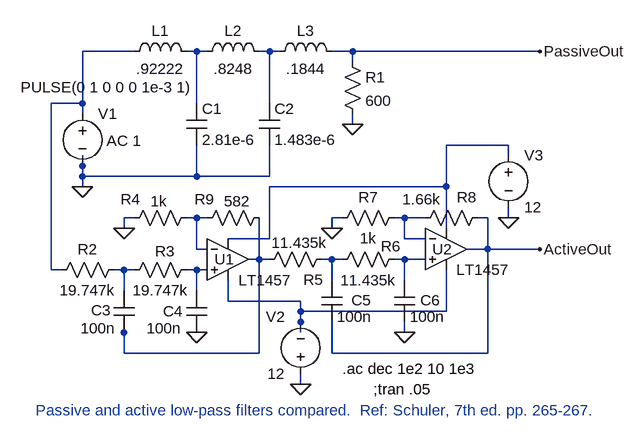
[diagram p0: schematic PassiveActive.asc]
PassiveActive.asc, the LTspice schematic file:
Version 4
SHEET 1 880 680
WIRE -224 -112 -304 -112
WIRE -128 -112 -144 -112
WIRE -112 -112 -128 -112
WIRE -16 -112 -32 -112
WIRE 0 -112 -16 -112
WIRE 112 -112 80 -112
WIRE 400 -112 112 -112
WIRE 112 -96 112 -112
WIRE -304 -32 -304 -112
WIRE -304 -32 -352 -32
WIRE -128 -32 -128 -112
WIRE -16 -32 -16 -112
WIRE -304 -16 -304 -32
WIRE 112 0 112 -16
WIRE 352 32 256 32
WIRE 352 48 352 32
WIRE -304 64 -304 48
WIRE -304 80 -304 64
WIRE -128 80 -128 32
WIRE -128 80 -304 80
WIRE -16 80 -16 32
WIRE -16 80 -128 80
WIRE -304 96 -304 80
WIRE 256 96 256 32
WIRE 256 96 -16 96
WIRE -224 144 -240 144
WIRE -128 144 -144 144
WIRE -112 144 -128 144
WIRE 96 144 80 144
WIRE 192 144 176 144
WIRE 224 144 192 144
WIRE 320 144 304 144
WIRE 352 144 352 128
WIRE -240 160 -240 144
WIRE 80 160 80 144
WIRE 256 160 256 96
WIRE -16 176 -16 96
WIRE -16 176 -80 176
WIRE 192 176 192 144
WIRE 224 176 192 176
WIRE -128 192 -128 144
WIRE -112 192 -128 192
WIRE 320 192 320 144
WIRE 320 192 288 192
WIRE 400 192 320 192
WIRE -32 208 -32 144
WIRE -32 208 -48 208
WIRE -16 208 -32 208
WIRE 80 208 64 208
WIRE 96 208 80 208
WIRE 192 208 176 208
WIRE 224 208 192 208
WIRE -352 224 -352 -32
WIRE -336 224 -352 224
WIRE -240 224 -256 224
WIRE -224 224 -240 224
WIRE -128 224 -144 224
WIRE -112 224 -128 224
WIRE 80 240 80 208
WIRE 192 240 192 208
WIRE -240 256 -240 224
WIRE -128 256 -128 224
WIRE -80 272 -80 240
WIRE 32 272 -80 272
WIRE 32 288 32 272
WIRE 256 288 256 224
WIRE 256 288 32 288
WIRE 32 304 32 288
WIRE -240 320 -240 304
WIRE -128 320 -128 304
WIRE 32 320 32 304
WIRE 192 320 192 304
WIRE -240 352 -240 320
WIRE -32 352 -32 208
WIRE -32 352 -240 352
WIRE 80 352 80 304
WIRE 320 352 320 192
WIRE 320 352 80 352
WIRE 32 400 32 384
FLAG -240 160 0
FLAG 80 160 0
FLAG -128 320 0
FLAG 192 320 0
FLAG 352 144 0
FLAG 32 400 0
FLAG 400 -112 PassiveOut
FLAG 400 192 ActiveOut
FLAG -304 96 0
FLAG 112 0 0
SYMBOL voltage -304 -32 R0
WINDOW 3 -95 -25 Left 0
WINDOW 123 37 57 Left 0
WINDOW 39 0 0 Left 0
SYMATTR Value PULSE(0 1 0 0 0 1e-3 1)
SYMATTR Value2 AC 1
SYMATTR InstName V1
SYMBOL ind -240 -96 R270
WINDOW 0 32 56 VTop 0
WINDOW 3 5 56 VBottom 0
SYMATTR InstName L1
SYMATTR Value .92222
SYMBOL ind -128 -96 R270
WINDOW 0 32 56 VTop 0
WINDOW 3 5 56 VBottom 0
SYMATTR InstName L2
SYMATTR Value .8248
SYMBOL ind -16 -96 R270
WINDOW 0 32 56 VTop 0
WINDOW 3 5 56 VBottom 0
SYMATTR InstName L3
SYMATTR Value .1844
SYMBOL res 96 -112 R0
SYMATTR InstName R1
SYMATTR Value 600
SYMBOL cap -144 -32 R0
SYMATTR InstName C1
SYMATTR Value 2.81e-6
SYMBOL cap -32 -32 R0
SYMATTR InstName C2
SYMATTR Value 1.483e-6
SYMBOL res -240 208 R90
WINDOW 0 0 56 VBottom 0
WINDOW 3 32 56 VTop 0
SYMATTR InstName R2
SYMATTR Value 19.747k
SYMBOL res -128 208 R90
WINDOW 0 3 49 VBottom 0
WINDOW 3 32 56 VTop 0
SYMATTR InstName R3
SYMATTR Value 19.747k
SYMBOL res -128 128 R90
WINDOW 0 3 102 VBottom 0
WINDOW 3 -25 58 VTop 0
SYMATTR InstName R4
SYMATTR Value 1k
SYMBOL res 80 192 R90
WINDOW 0 63 28 VBottom 0
WINDOW 3 -25 50 VTop 0
SYMATTR InstName R5
SYMATTR Value 11.435k
SYMBOL res 192 192 R90
WINDOW 0 11 21 VBottom 0
WINDOW 3 32 56 VTop 0
SYMATTR InstName R6
SYMATTR Value 11.435k
SYMBOL res 192 128 R90
WINDOW 0 0 56 VBottom 0
WINDOW 3 32 56 VTop 0
SYMATTR InstName R7
SYMATTR Value 1k
SYMBOL res 320 128 R90
WINDOW 0 0 32 VBottom 0
WINDOW 3 -28 102 VTop 0
SYMATTR InstName R8
SYMATTR Value 1.66k
SYMBOL res -16 128 R90
WINDOW 0 3 100 VBottom 0
WINDOW 3 -25 50 VTop 0
SYMATTR InstName R9
SYMATTR Value 582
SYMBOL cap -256 256 R0
WINDOW 0 -35 30 Left 0
WINDOW 3 -51 58 Left 0
SYMATTR InstName C3
SYMATTR Value 100n
SYMBOL cap -144 256 R0
WINDOW 0 -36 32 Left 0
WINDOW 3 -61 58 Left 0
SYMATTR InstName C4
SYMATTR Value 100n
SYMBOL cap 64 240 R0
WINDOW 0 46 31 Left 0
SYMATTR InstName C5
SYMATTR Value 100n
SYMBOL cap 176 240 R0
WINDOW 0 40 31 Left 0
SYMATTR InstName C6
SYMATTR Value 100n
SYMBOL voltage 32 400 R180
WINDOW 0 24 104 Left 0
WINDOW 3 24 16 Left 0
WINDOW 123 0 0 Left 0
WINDOW 39 0 0 Left 0
SYMATTR InstName V2
SYMATTR Value 12
SYMBOL voltage 352 32 R0
WINDOW 123 0 0 Left 0
WINDOW 39 0 0 Left 0
SYMATTR InstName V3
SYMATTR Value 12
SYMBOL Opamps\\LT1457 -80 208 R0
WINDOW 0 -21 0 Left 0
SYMATTR InstName U1
SYMBOL Opamps\\LT1457 256 192 R0
WINDOW 0 -21 0 Left 0
SYMATTR InstName U2
TEXT 96 376 Left 0 !.ac dec 1e2 10 1e3
TEXT 144 408 Left 0 !;tran .05
TEXT -376 440 Left 0 ;Passive and active low-pass filters compared.  Ref: Schuler, 7th ed. pp. 265-267.

The netlist it stands for:
* PassiveActive.asc
V1 N001 0 PULSE(0 1 0 0 0 1e-3 1) AC 1
L1 N001 N002 .92222
L2 N002 N003 .8248
L3 N003 PassiveOut .1844
R1 PassiveOut 0 600
C1 N002 0 2.81e-6
C2 N003 0 1.483e-6
R2 N010 N001 19.747k
R3 N011 N010 19.747k
R4 N005 0 1k
R5 N008 N007 11.435k
R6 N009 N008 11.435k
R7 N006 0 1k
R8 ActiveOut N006 1.66k
R9 N007 N005 582
C3 N010 N007 100n
C4 N011 0 100n
C5 N008 ActiveOut 100n
C6 N009 0 100n
V2 0 N012 12
V3 N004 0 12
* U1: LT1457 (symbol Opamps\LT1457 not available, pins judged from their places): In+=N011 In-=N005 V+=N004 V-=N012 OUT=N007
* U2: LT1457 (symbol Opamps\LT1457 not available, pins judged from their places): In+=N009 In-=N006 V+=N004 V-=N012 OUT=ActiveOut
.ac dec 1e2 10 1e3
;tran .05
* Passive and active low-pass filters compared.  Ref: Schuler, 7th ed. pp. 265-267.
.backanno
.end